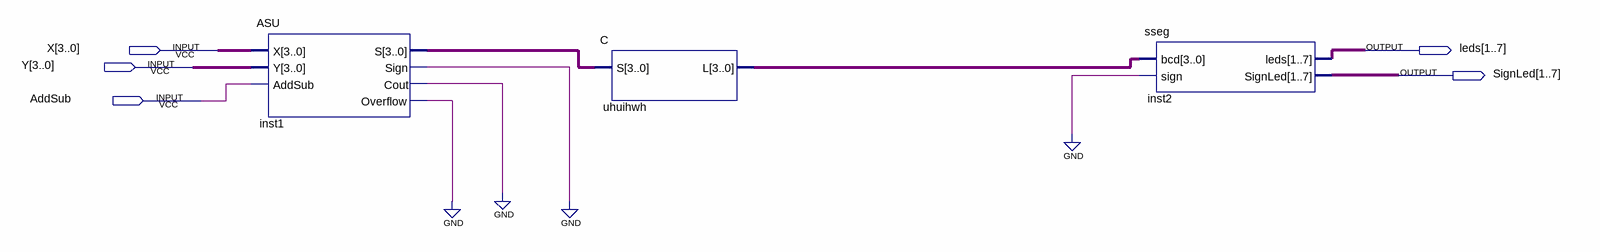
[diagram p0: schematic sheet]
// Quartus schematic CombinedASU2.bdf as structural Verilog: 3 symbols, 5 pins
module CombinedASU2 (
  input  [3:0] X,
  input  [3:0] Y,
  input  AddSub,
  output [1:7] leds,
  output [1:7] SignLed
);

  wire inst1_cout, inst1_overflow, inst1_sign;
  wire [3:0] inst1_s, uhuihwh_l;

  ASU inst1 (
    .X(X), .Y(Y), .AddSub(AddSub), .S(inst1_s), .Sign(inst1_sign), .Cout(inst1_cout),
    .Overflow(inst1_overflow));
  C uhuihwh (.S(inst1_s), .L(uhuihwh_l));
  sseg inst2 (.bcd(uhuihwh_l), .sign(1'b0), .leds(leds), .SignLed(SignLed));
  // also tied to GND on the sheet: {inst1_overflow, inst1_cout, inst1_sign}
endmodule
